# EAGLE design MAVCam (EAGLE 6.5.0)
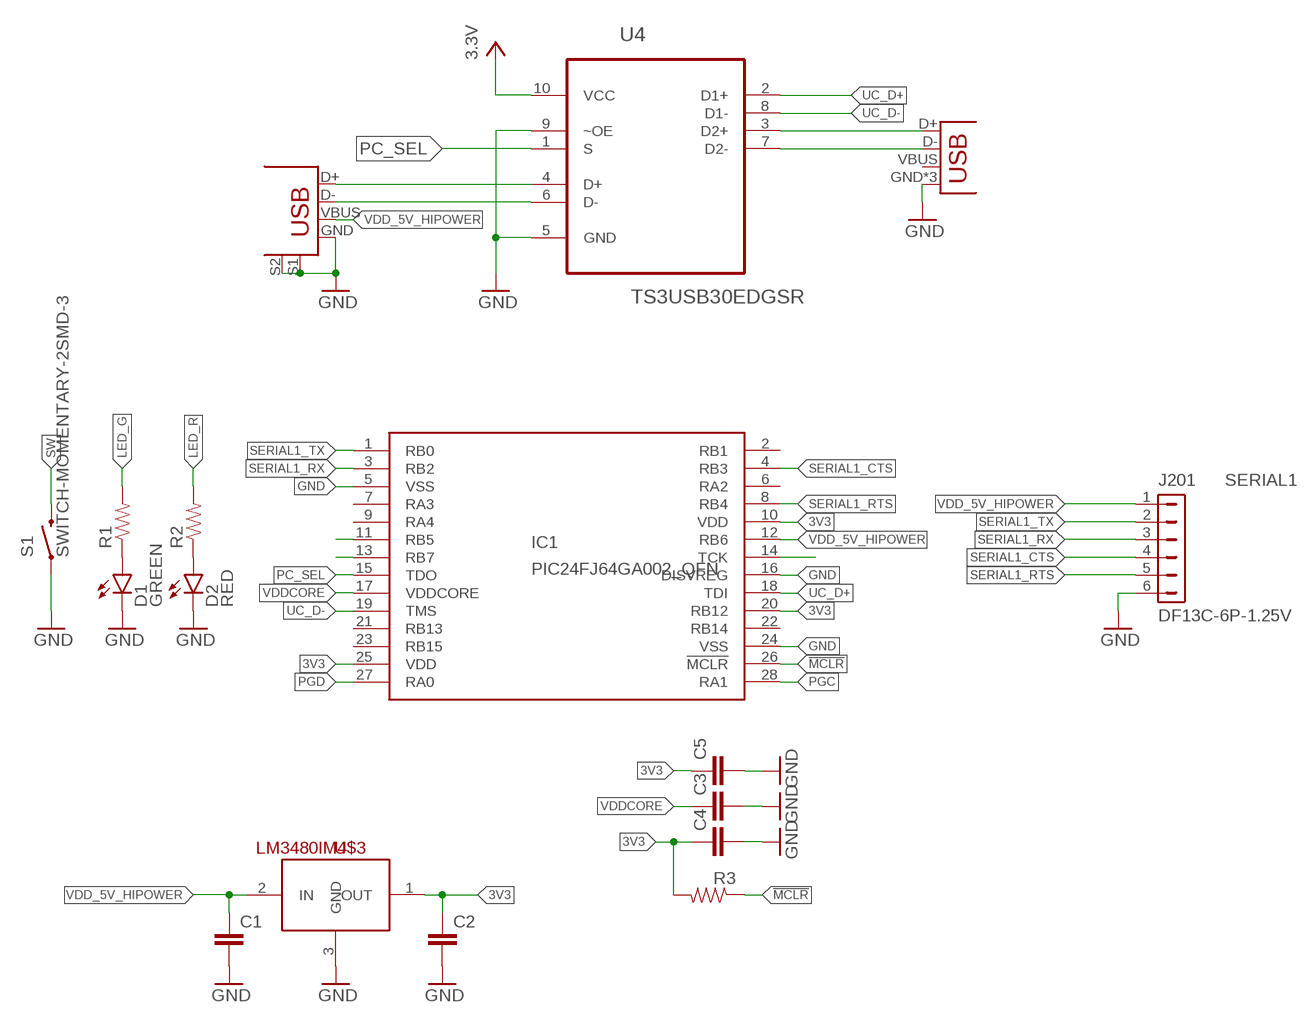
[diagram p0: schematic, sheet 1]

## Parts
C1  CAP0603-CAP  [0603-CAP]
C2  CAP0603-CAP  [0603-CAP]
C3  CAP0603-CAP  [0603-CAP]
C4  CAP0603-CAP  [0603-CAP]
C5  CAP0603-CAP  [0603-CAP]
D1  GREEN  LED-GREEN0603  [LED-0603]
D2  RED  LED-RED0603  [LED-0603]
IC1  PIC24FJ64GA002_QFN  [QFN28-ML_6X6MM]
J201  DF13C-6P-1.25V  DF13-6P-1.25V  [DF13C-6P-1.25V]
JP1  USB-MICROB  [USB-MICROB]
R1  RESISTOR0603-RES  [0603-RES]
R2  RESISTOR0603-RES  [0603-RES]
R3  RESISTOR0603-RES  [0603-RES]
S1  SWITCH-MOMENTARY-2SMD-3  [TACTILE_SWITCH_SMD-3]
U4  TS3USB30EDGSR  [SOP50P490X110-10N]
U$1  USB+SHIELDUSB-A-S-NOSILK-FEMALE  [USB-A-S-NOSILK-FEMALE]
U$3  LM3480IM4  [SOT23-3]

## Nets
3V3: C2.1 C4.1 C5.1 IC1.10(VDD) IC1.20(RB12) IC1.25(VDD) R3.2 U4.10(VCC) U$3.1(OUT) ; supply symbol labelled 3.3V
!MCLR: IC1.26(!MCLR) R3.1
GND [power]: C1.2 C2.2 C3.2 C4.2 C5.2 D1.C D2.C IC1.5(VSS) IC1.16(DISVREG) IC1.24(VSS) J201.6 JP1.GND JP1.MT1(GND) JP1.MT2(GND) S1.1 U4.5(GND) U4.9(~OE) U$1.GND U$1.S1 U$1.S2 U$3.3(GND)
LED_G: IC1.13(RB7) R1.2
LED_R: IC1.11(RB5) R2.2
N$1: U4.4(D+) U$1.D+
N$2: U4.6(D-) U$1.D-
N$3: D1.A R1.1
N$4: D2.A R2.1
PC_D+: JP1.D+ U4.3(D2+)
PC_D-: JP1.D- U4.7(D2-)
PC_SEL: IC1.15(TDO) U4.1(S)
PGC: IC1.28(RA1)
PGD: IC1.27(RA0)
SERIAL1_CTS: IC1.4(RB3) J201.4
SERIAL1_RTS: IC1.8(RB4) J201.5
SERIAL1_RX: IC1.3(RB2) J201.3
SERIAL1_TX: IC1.1(RB0) J201.2
SW: IC1.14(TCK) S1.4
UC_D+: IC1.18(TDI) U4.2(D1+)
UC_D-: IC1.19(TMS) U4.8(D1-)
VDD_5V_HIPOWER [power]: C1.1 IC1.12(RB6) J201.1 U$1.VBUS U$3.2(IN)
VDDCORE: C3.1 IC1.17(VDDCORE)
Unconnected: IC1.2(RB1) IC1.6(RA2) IC1.7(RA3) IC1.9(RA4) IC1.21(RB13) IC1.22(RB14) IC1.23(RB15) JP1.VBUS

## Notes on the sheet
- SERIAL1

## Library data of the parts
C1-C5 = SparkFun-Passives:CAP: Capacitor Standard 0603 ceramic capacitor, and 0.1" leaded capacitor.
D1 = SparkFun-LED:LED-GREEN: Various green LEDs Green LEDs used in SFE Production 0603- DIO-00821 LARGE- DIO-00862 LILYPAD- DIO-09910; PROD_ID: DIO-00821
D2 = SparkFun-LED:LED-RED: Assorted Red LEDs LilyPad 1206- DIO-09912 1206- DIO-00809 0603- DIO-00819; PROD_ID: DIO-00819
IC1 = microchip:PIC24FJ64GA002_QFN: PIC24FJ64GA002_QFN edit this description Auto generated by make-symbol-device-package-bsdl.ulp Rev. 25 Source: PIC24FJ64GA002_QFN.bsd; MPN: PIC24FJ64GA002-E/ML; OC_FARNELL: 1818728; OC_NEWARK: 98M1922
J201 = con-hirose-df13:DF13-6P-1.25: DF13-6P 1.25mm Pitch Miniature Crimping Connector.; PARTNO: DF13C-6P-1.25V(20)
JP1 = SparkFun-Connectors:USB: USB Connectors USB-B-PTH is fully proven SKU : PRT-00139/CONN-08278 USB-miniB is fully proven SKU : PRT-00587 USB-A-PCB is untested. USB-A-H is throughly reviewed, but untested. Spark Fun Electronics SKU : PRT-00437 USB-B-SMT is throughly reviewed, but untested. Needs silkscreen touching up. USB-A-S has not been used/tested USB-MB-H has not been used/tested USB-MICROB has been used. CONN-09505; PROD_ID: CONN-09505
R1-R3 = SparkFun-Passives:RESISTOR: Resistor Basic schematic elements and footprints for 0603, 1206, and PTH resistors.
S1 = SparkFun-Electromechanical:SWITCH-MOMENTARY-2: Various NO switches- pushbuttons, reed, etc
U4 = Texas Instruments_By_element14_Batch_1:TS3USB30EDGSR: 1:2 MULTIPLEXER/DEMULTIPLEXER; MPN: TS3USB30EDGSR; OC_FARNELL: -; OC_NEWARK: 64R0806; PACKAGE: MSOP-10; SUPPLIER: Texas Instruments
U$1 = SparkFun-Connectors:USB+SHIELD: USB+Shield USB connector with shield pins connectable
U$3 = SparkFun-PowerIC:LM3480IM4: Small package linear regulator

## Net classes
0 default: width 0.152 mm
1 power: width 0.15 mm, drill 0.2 mm, clearance 0.152 mm

## Board
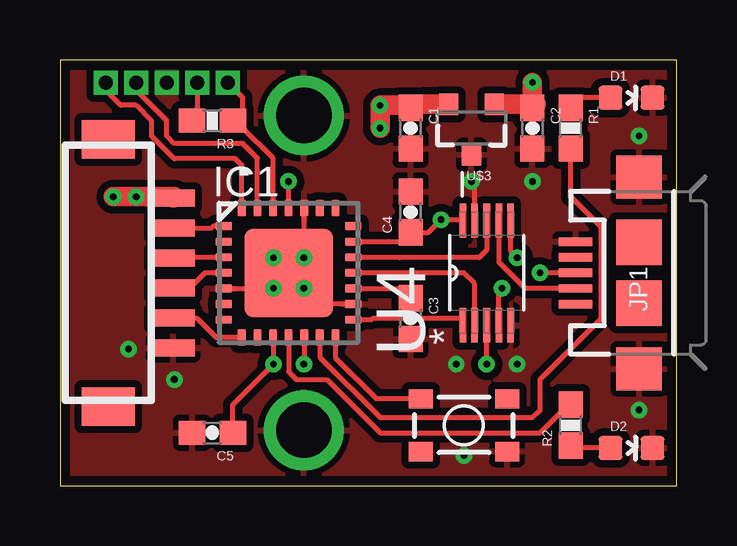
[diagram p1: board, top side]
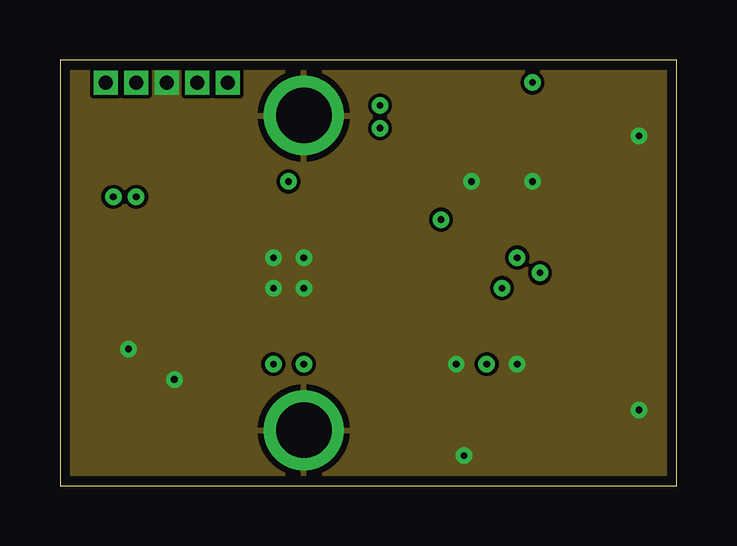
[diagram p2: board, inner layer Route2]
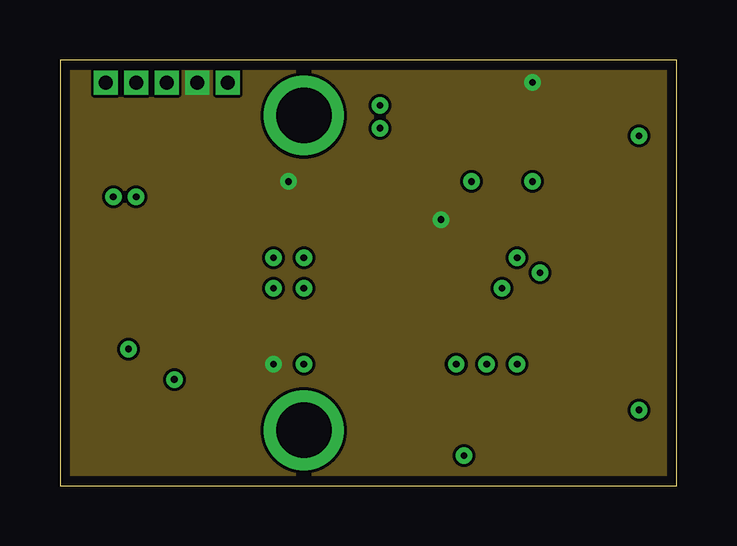
[diagram p3: board, inner layer Route3]
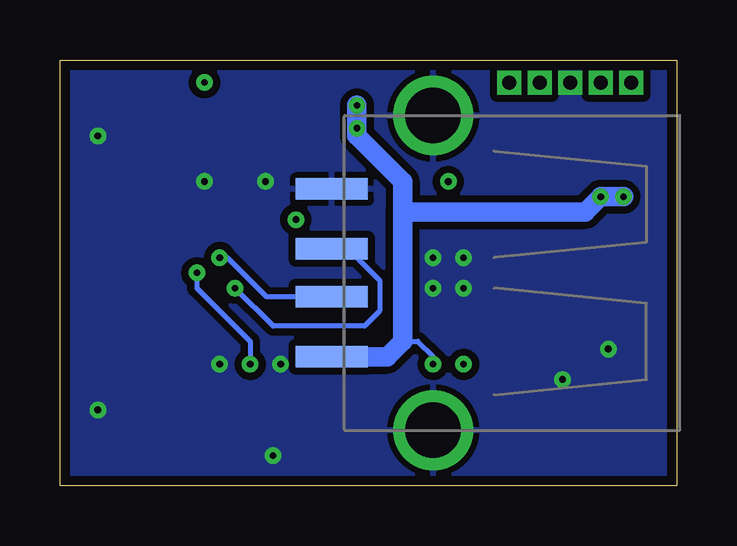
[diagram p4: board, bottom side, seen from below]

Size 25.71 x 17.77 mm. Coordinates in mm from the lower left corner, seen from the top.
Outline: 0,0 25.71,0 25.71,17.77 0,17.77 0,0
Copper layers (1*2*3*16): Top 0.035mm / dielectric 1.5mm / Route2 0.035mm / dielectric 0.15mm / Route3 0.035mm / dielectric 0.2mm / Bottom 0.035mm
Design rules "default *": minimum track width 5mil, minimum drill 10mil, track to track 5mil, track to pad 6mil, pad to pad 6mil, via to via 6mil, smd to smd 6mil, copper to edge 16mil, drill to drill 8mil, minimum pad ring 10mil, minimum via ring 8mil, stop-mask expansion 4mil, vias tented up to drill 20mil, thermal gap 10mil

### Footprints (pad centres in the part's own frame; a part is rotated, then mirrored left to right if it is on the bottom)
0603-CAP = smd 1.1 x 1: 1 -0.85,0; 2 0.85,0
LED-0603 = smd 1 x 1: A 0,-0.877; C 0,0.877
QFN28-ML_6X6MM = smd 0.7 x 0.35: 1 -2.7,1.95; 2 -2.7,1.3; 3 -2.7,0.65; 4 -2.7,0; 5 -2.7,-0.65; 6 -2.7,-1.3; 7 -2.7,-1.95; 15 2.7,-1.95; 16 2.7,-1.3; 17 2.7,-0.65; 18 2.7,0; 19 2.7,0.65; 20 2.7,1.3; 21 2.7,1.95 | smd 0.35 x 0.7: 8 -1.95,-2.7; 9 -1.3,-2.7; 10 -0.65,-2.7; 11 0,-2.7; 12 0.65,-2.7; 13 1.3,-2.7; 14 1.95,-2.7; 22 1.95,2.7; 23 1.3,2.7; 24 0.65,2.7; 25 0,2.7; 26 -0.65,2.7; 27 -1.3,2.7; 28 -1.95,2.7 | smd 3.7 x 3.7: EXP 0,0
DF13C-6P-1.25V = smd 0.7 x 1.8: 1 -3.125,0.9; 2 -1.875,0.9; 3 -0.625,0.9; 4 0.625,0.9; 5 1.875,0.9; 6 3.125,0.9 | smd 1.6 x 2.2: M$0 5.575,-1.8; M$1 -5.575,-1.8
USB-MICROB = smd 0.35 x 1.4: D+ 0,2.65; D- -0.65,2.65; GND 1.3,2.65; ID 0.65,2.65; VBUS -1.3,2.65 | smd 1.8 x 1.9: MT1 -4,0; MT2 4,0 | smd 1.9 x 1.9: P$1 -1.27,0; P$2 1.27,0
0603-RES = smd 1.1 x 1: 1 -0.85,0; 2 0.85,0
TACTILE_SWITCH_SMD-3 = smd 1 x 0.8: 1 -1.8,1.1; 2 1.8,1.1; 3 -1.8,-1.1; 4 1.8,-1.1
SOP50P490X110-10N = smd 1.422 x 0.279: 1 -2.184,0.991; 2 -2.184,0.508; 3 -2.184,0; 4 -2.184,-0.508; 5 -2.184,-0.991; 6 2.184,-0.991; 7 2.184,-0.508; 8 2.184,0; 9 2.184,0.508; 10 2.184,0.991
USB-A-S-NOSILK-FEMALE = smd 3 x 0.9: D+ 4.212,-1; D- 4.212,1; GND 4.212,-3.5; VBUS 4.212,3.5 | drill 2.311: S1 0,-6.566; S2 0,6.566
SOT23-3 = smd 0.8 x 0.9: 1 -0.95,-1; 2 0.95,-1; 3 0,1.1

### Placement (x,y rotation side)
C1  14.61,14.92 270 top
C2  19.68,14.92 270 top
C3  14.61,6.99 270 top
C4  14.61,11.43 90 top
C5  6.35,2.22 180 top
D1  23.81,16.19 270 top
D2  23.81,1.59 270 top
IC1  9.53,8.89 0 top
J201  3.81,8.89 270 top
JP1  24.13,8.89 90 top
R1  21.27,14.92 270 top
R2  21.27,2.54 90 top
R3  6.35,15.24 180 top
S1  16.83,2.54 180 top
U4  17.78,8.89 90 top
U$1  10.16,8.89 180 bottom
U$3  17.14,14.92 180 top

### Tracks (layer width: path | path; a pad name or v marks a point on that pad's centre or on a via)
3V3  (via drill 0.28 pad 0.1, 0.58 pad 0.64)
  Top 0.203: U4.10 16.75,11.11 v15.88,11.11 15.34,10.58 C4.1 14.53,10.19 IC1.20 | IC1.10 8.88,5.09 v8.89,5.08 7.2,3.39 C5.1 | IC1.25 v9.53,12.7 | v5.71,16.83 5.71,15.77 R3.2
  Top 0.813: U$3.1 19.85,15.92 C2.1 v19.68,16.83
  pour Route3: 0,11.43 0,0 26.35,0 26.35,17.78 0,17.78
!MCLR  (via drill 0.58 pad 0.64)
  Top 0.203: IC1.26 8.88,13.67 7.62,14.92 7.62,15.56 | R3.1 7.62,15.56 | 7.62,15.56 7.62,16.19 v6.99,16.83
GND  (via drill 0.28 pad 0.1, 0.58 pad 0.64)
  Top 0.203: IC1.5 10.18,8.24 v10.16,8.26 10.83,7.59 IC1.16 | U4.9 17.27,12.7 v17.14,12.7 | IC1.24 10.16,11.59 v10.16,9.53
  other vias: 8.89,9.53 8.89,8.26 4.45,16.83 16.51,5.08 24.13,3.17 24.13,14.61 19.68,12.7 19.05,5.08 16.83,1.27 4.76,4.45 2.86,5.71
  pour Route2: -0.32,18.1 -0.32,-0.32 26.35,-0.32 26.35,18.1
  pour Top (isolate 0.305): 0,18.1 0,-0.32 26.67,-0.32 26.67,18.1
  pour Bottom (isolate 0.305): -0.32,18.41 -0.32,0 26.35,0 26.35,18.41
LED_G
  Top 0.203: IC1.13 10.83,5.37 13.34,2.86 19.68,2.86 20,3.17 20,4.45 22.54,6.99 22.54,10.79 21.27,12.06 R1.2
LED_R
  Top 0.203: IC1.11 9.53,4.76 9.84,4.45 11.11,4.45 13.34,2.22 20,2.22 21.17,3.39 R2.2
N$1  (via drill 0.28 pad 0.1)
  Top 0.203: U4.4 18.29,8.13 v18.41,8.26
  Bottom 0.203: U$1.D+ 13.7,9.89 12.38,8.57 12.38,7.3 13.02,6.67 16.83,6.67 v18.41,8.26
N$2  (via drill 0.28 pad 0.1)
  Top 0.203: U4.6 18.77,9.8 v19.05,9.53
  Bottom 0.203: U$1.D- 17.1,7.89 18.73,9.53 v19.05,9.53
N$3
  Top 0.203: D1.A 21.69,16.19 R1.1
N$4
  Top 0.203: D2.A 21.69,1.59 R2.1
PC_D+  (via drill 0.28 pad 0.1)
  Top 0.203: JP1.D+ v20,8.89 | v17.78,5.08 U4.3
  Bottom 0.203: v20,8.89 20,8.26 17.78,6.03 v17.78,5.08
PC_D-
  Top 0.203: JP1.D- 19.38,8.24 18.29,9.34 U4.7
PC_SEL
  Top 0.203: U4.1 16.79,6.95 16.83,6.99 13.02,6.99 12.97,6.94 IC1.15
PGC  (via drill 0.58 pad 0.64)
  Top 0.203: IC1.28 7.58,13.38 7.3,13.65 4.76,13.65 3.81,14.61 3.81,15.24 3.18,15.88 2.54,15.88 1.9,16.51 v1.9,16.83
PGD  (via drill 0.58 pad 0.64)
  Top 0.203: IC1.27 8.22,13.68 7.62,14.29 4.76,14.29 4.45,14.61 4.45,15.24 3.18,16.51 v3.18,16.83
SERIAL1_CTS
  Top 0.203: IC1.4 6.03,8.89 5.4,8.26 4.72,8.26 J201.4
SERIAL1_RTS
  Top 0.203: IC1.8 6.51,6.19 5.71,6.99 4.74,6.99 J201.5
SERIAL1_RX
  Top 0.203: IC1.3 4.73,9.54 J201.3
SERIAL1_TX
  Top 0.203: IC1.1 6.39,10.84 6.32,10.77 J201.2
SW
  Top 0.203: IC1.14 11.47,5.35 13.19,3.64 S1.4
UC_D+
  Top 0.203: U4.2 17.27,8.45 16.83,8.89 IC1.18
UC_D-
  Top 0.203: U4.8 17.78,9.84 17.46,9.53 14.14,9.53 IC1.19
VDD_5V_HIPOWER  (via drill 0.28 pad 0.1, 0.28 pad 0.64)
  Top 0.203: 10.16,5.4 v10.16,5.08 10.18,5.38 IC1.12
  Top 0.813: U$3.2 15.07,15.92 C1.1 14.92,15.88 v13.34,15.88 v13.34,14.92 | J201.1 4.76,12.07 v3.18,12.06 v2.22,12.06
  Bottom 0.203: 11.43,6.03 10.79,6.03 10.16,5.4 v10.16,5.08
  Bottom 0.813: 11.43,11.43 3.81,11.43 v3.18,12.06 v2.22,12.06 | U$1.VBUS 12.07,5.39 11.43,6.03 11.43,11.43 | v13.34,15.88 v13.34,14.92 13.34,14.61 11.43,12.7 11.43,11.43
VDDCORE
  Top 0.203: IC1.17 14.52,8.24 C3.1